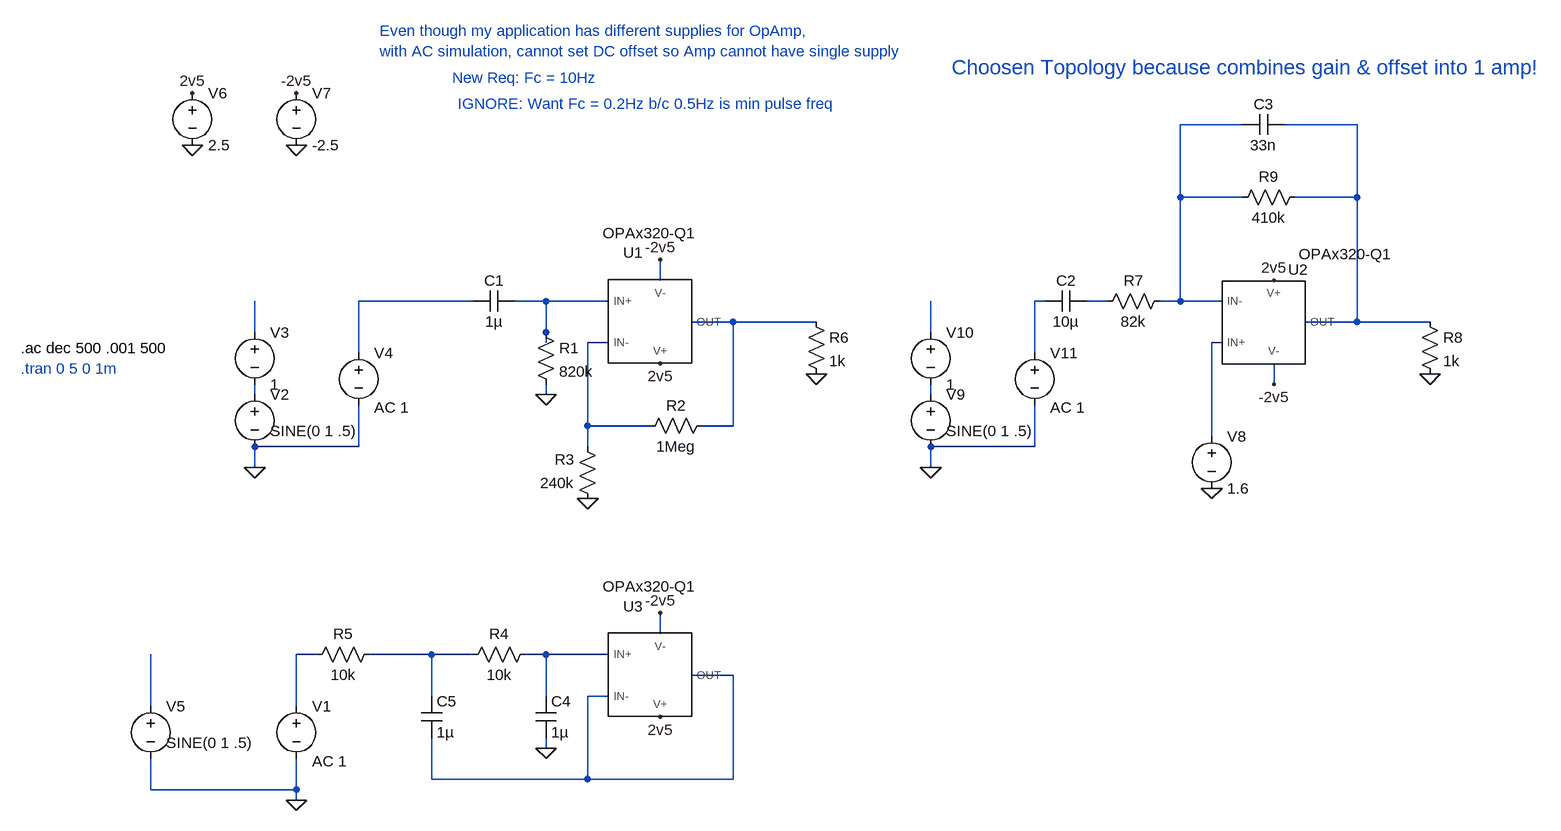
[diagram p0: schematic HPF.asc]
HPF.asc, the LTspice schematic file:
Version 4.1
SHEET 1 1848 1268
WIRE 1168 -112 1072 -112
WIRE 1344 -112 1232 -112
WIRE 1072 0 1072 -112
WIRE 1168 0 1072 0
WIRE 1344 0 1344 -112
WIRE 1344 0 1248 0
WIRE 272 128 272 96
WIRE -16 160 -192 160
WIRE 96 160 48 160
WIRE 192 160 96 160
WIRE 864 160 848 160
WIRE 960 160 928 160
WIRE 1072 160 1072 0
WIRE 1072 160 1040 160
WIRE 1136 160 1072 160
WIRE 384 192 320 192
WIRE 512 192 384 192
WIRE 1344 192 1344 0
WIRE 1344 192 1264 192
WIRE 1456 192 1344 192
WIRE -352 208 -352 160
WIRE 96 208 96 160
WIRE 688 208 688 160
WIRE 96 224 96 208
WIRE 192 224 160 224
WIRE 1136 224 1120 224
WIRE -192 240 -192 160
WIRE 848 240 848 160
WIRE 1216 288 1216 256
WIRE -352 304 -352 288
WIRE 96 304 96 288
WIRE 688 304 688 288
WIRE 160 352 160 224
WIRE 256 352 160 352
WIRE 384 352 384 192
WIRE 384 352 336 352
WIRE 1120 368 1120 224
WIRE -192 384 -192 320
WIRE -192 384 -352 384
WIRE 160 384 160 352
WIRE 848 384 848 320
WIRE 848 384 688 384
WIRE -352 416 -352 384
WIRE 688 416 688 384
WIRE 272 672 272 640
WIRE -256 704 -288 704
WIRE -80 704 -176 704
WIRE -16 704 -80 704
WIRE 96 704 64 704
WIRE 192 704 96 704
WIRE 384 736 320 736
WIRE -80 768 -80 704
WIRE 96 768 96 704
WIRE 192 768 160 768
WIRE -512 784 -512 704
WIRE -288 784 -288 704
WIRE 96 848 96 832
WIRE -80 896 -80 832
WIRE 160 896 160 768
WIRE 160 896 -80 896
WIRE 384 896 384 736
WIRE 384 896 160 896
WIRE -512 912 -512 864
WIRE -288 912 -288 864
WIRE -288 912 -512 912
WIRE -288 928 -288 912
FLAG 96 304 0
FLAG 272 256 2v5
FLAG -352 416 0
FLAG -448 -80 0
FLAG -448 -160 2v5
FLAG -288 -80 0
FLAG -288 -160 -2v5
FLAG 272 96 -2v5
FLAG 96 848 0
FLAG 272 800 2v5
FLAG -288 928 0
FLAG 272 640 -2v5
FLAG 160 464 0
FLAG 512 272 0
FLAG 1456 272 0
FLAG 1120 448 0
FLAG 688 416 0
FLAG 1216 128 2v5
FLAG 1216 288 -2v5
SYMBOL OPAx320-Q1 256 192 M180
WINDOW 0 -26 122 Bottom 2
WINDOW 3 -1 121 Top 2
SYMATTR InstName U1
SYMBOL voltage -352 288 R0
WINDOW 3 24 72 Left 2
WINDOW 123 24 44 Left 2
WINDOW 39 0 0 Left 0
SYMATTR Value SINE(0 1 .5)
SYMATTR InstName V2
SYMBOL voltage -352 192 R0
WINDOW 123 0 0 Left 0
WINDOW 39 0 0 Left 0
SYMATTR InstName V3
SYMATTR Value 1
SYMBOL voltage -192 224 R0
WINDOW 3 24 72 Left 2
WINDOW 123 24 100 Left 2
WINDOW 39 0 0 Left 0
SYMATTR Value ""
SYMATTR Value2 AC 1
SYMATTR InstName V4
SYMBOL voltage -448 -176 R0
WINDOW 123 0 0 Left 0
WINDOW 39 0 0 Left 0
SYMATTR InstName V6
SYMATTR Value 2.5
SYMBOL voltage -288 -176 R0
WINDOW 123 0 0 Left 0
WINDOW 39 0 0 Left 0
SYMATTR InstName V7
SYMATTR Value -2.5
SYMBOL OPAx320-Q1 256 736 M180
WINDOW 0 -26 122 Bottom 2
WINDOW 3 -1 121 Top 2
SYMATTR InstName U3
SYMBOL res 80 688 R90
WINDOW 0 0 56 VBottom 2
WINDOW 3 32 56 VTop 2
SYMATTR InstName R4
SYMATTR Value 10k
SYMBOL cap 80 768 R0
SYMATTR InstName C4
SYMATTR Value 1µ
SYMBOL res -160 688 R90
WINDOW 0 0 56 VBottom 2
WINDOW 3 32 56 VTop 2
SYMATTR InstName R5
SYMATTR Value 10k
SYMBOL cap -96 768 R0
SYMATTR InstName C5
SYMATTR Value 1µ
SYMBOL voltage -288 768 R0
WINDOW 3 24 72 Left 2
WINDOW 123 24 100 Left 2
WINDOW 39 0 0 Left 0
SYMATTR Value ""
SYMATTR Value2 AC 1
SYMATTR InstName V1
SYMBOL voltage -512 768 R0
WINDOW 3 24 72 Left 2
WINDOW 123 24 44 Left 2
WINDOW 39 0 0 Left 0
SYMATTR Value SINE(0 1 .5)
SYMATTR InstName V5
SYMBOL cap 48 144 R90
WINDOW 0 0 32 VBottom 2
WINDOW 3 32 32 VTop 2
SYMATTR InstName C1
SYMATTR Value 1µ
SYMBOL res 80 192 R0
SYMATTR InstName R1
SYMATTR Value 820k
SYMBOL res 352 336 R90
WINDOW 0 0 56 VBottom 2
WINDOW 3 32 56 VTop 2
SYMATTR InstName R2
SYMATTR Value 1Meg
SYMBOL res 176 480 R180
WINDOW 0 36 76 Left 2
WINDOW 3 36 40 Left 2
SYMATTR InstName R3
SYMATTR Value 240k
SYMBOL res 496 176 R0
SYMATTR InstName R6
SYMATTR Value 1k
SYMBOL OPAx320-Q1 1200 192 R0
WINDOW 0 53 -65 Bottom 2
WINDOW 3 126 -120 Top 2
SYMATTR InstName U2
SYMBOL cap 928 144 R90
WINDOW 0 0 32 VBottom 2
WINDOW 3 32 32 VTop 2
SYMATTR InstName C2
SYMATTR Value 10µ
SYMBOL res 1056 144 R90
WINDOW 0 0 56 VBottom 2
WINDOW 3 32 56 VTop 2
SYMATTR InstName R7
SYMATTR Value 82k
SYMBOL res 1440 176 R0
SYMATTR InstName R8
SYMATTR Value 1k
SYMBOL res 1264 -16 R90
WINDOW 0 0 56 VBottom 2
WINDOW 3 32 56 VTop 2
SYMATTR InstName R9
SYMATTR Value 410k
SYMBOL voltage 1120 352 R0
WINDOW 123 0 0 Left 0
WINDOW 39 0 0 Left 0
SYMATTR InstName V8
SYMATTR Value 1.6
SYMBOL voltage 688 288 R0
WINDOW 3 24 72 Left 2
WINDOW 123 24 44 Left 2
WINDOW 39 0 0 Left 0
SYMATTR Value SINE(0 1 .5)
SYMATTR InstName V9
SYMBOL voltage 688 192 R0
WINDOW 123 0 0 Left 0
WINDOW 39 0 0 Left 0
SYMATTR InstName V10
SYMATTR Value 1
SYMBOL voltage 848 224 R0
WINDOW 3 24 72 Left 2
WINDOW 123 24 100 Left 2
WINDOW 39 0 0 Left 0
SYMATTR Value ""
SYMATTR Value2 AC 1
SYMATTR InstName V11
SYMBOL cap 1232 -128 R90
WINDOW 0 0 32 VBottom 2
WINDOW 3 32 32 VTop 2
SYMATTR InstName C3
SYMATTR Value 33n
TEXT -40 -144 Left 2 ;IGNORE: Want Fc = 0.2Hz b/c 0.5Hz is min pulse freq
TEXT -712 232 Left 2 !.ac dec 500 .001 500
TEXT -712 264 Left 2 ;.tran 0 5 0 1m
TEXT -160 -256 Left 2 ;Even though my application has different supplies for OpAmp, \nwith AC simulation, cannot set DC offset so Amp cannot have single supply
TEXT -48 -184 Left 2 ;New Req: Fc = 10Hz
TEXT 720 -200 Left 3 ;Choosen Topology because combines gain & offset into 1 amp!

The netlist it stands for:
* HPF.asc
X§U1 N004 N010 2v5 -2v5 N007 OPAx320-Q1  ; pins IN+ IN- V+ V- OUT
V2 N012 0 SINE(0 1 .5)
V3 N008 N012 1
V4 N003 0 AC 1
V6 2v5 0 2.5
V7 -2v5 0 -2.5
X§U3 N016 N017 2v5 -2v5 N017 OPAx320-Q1  ; pins IN+ IN- V+ V- OUT
R4 N016 N015 10k
C4 N016 0 1µ
R5 N015 N014 10k
C5 N015 N017 1µ
V1 N014 0 AC 1
V5 N018 0 SINE(0 1 .5)
C1 N004 N003 1µ
R1 N004 0 820k
R2 N007 N010 1Meg
R3 0 N010 240k
R6 N007 0 1k
X§U2 N011 N001 2v5 -2v5 N002 OPAx320-Q1  ; pins IN+ IN- V+ V- OUT
C2 N006 N005 10µ
R7 N001 N006 82k
R8 N002 0 1k
R9 N002 N001 410k
V8 N011 0 1.6
V9 N013 0 SINE(0 1 .5)
V10 N009 N013 1
V11 N005 0 AC 1
C3 N002 N001 33n
* IGNORE: Want Fc = 0.2Hz b/c 0.5Hz is min pulse freq
.ac dec 500 .001 500
* .tran 0 5 0 1m
* Even though my application has different supplies for OpAmp,
* with AC simulation, cannot set DC offset so Amp cannot have single supply
* New Req: Fc = 10Hz
* Choosen Topology because combines gain & offset into 1 amp!
.lib C:\Users\adnan\OneDrive\Documents\LTspice\MyLib\OPAx320-Q1.LIB
.backanno
.end